# Altium schematic sheet Servo Connectors.SchDoc
size A4
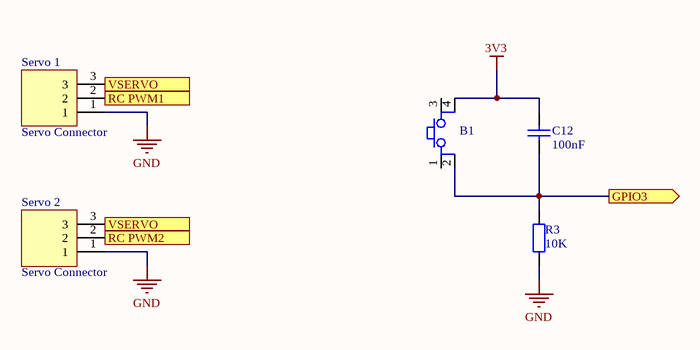
[diagram p0: Servo Connectors.SchDoc]

## Parts
B1  Button  [FP_BTN_SMD]  (value not drawn)
C12  100nF  [FP_0402_CAP_050]
R3  10K  [FP_0603_RES]
Servo_1  Servo Connector  [FP_CONN3_TAP_254MM]
Servo_2  Servo Connector  [FP_CONN3_TAP_254MM]

## Ports
GPIO3 (out), RC PWM1 (in), RC PWM2 (in), VSERVO (in)

## Nets
3V3: B1.4 C12.2
GND: R3.1 Servo_1.1 Servo_2.1
GPIO3: B1.2 C12.1 R3.2 ; port GPIO3
RC PWM1: Servo_1.2 ; port RC PWM1
RC PWM2: Servo_2.2 ; port RC PWM2
VSERVO: Servo_1.3 Servo_2.3 ; port VSERVO

Not connected (* = marked no-connect by the designer): B1 1 3

## Library data of the parts
B1 = Button 4P: Push button
C12 = CAP: Capacitor; Supplier: Farnell; Reference: https://hu.farnell.com/avx/02016d104kat2a/cap-0-1-f-6-3v-10-x5r-0201/dp/1657913; Value: 100nF
R3 = RES: Resistor; Supplier: Farnell; Reference: https://hu.farnell.com/vishay/crcw010010k0frel/res-10k-1-0-031w-01005-thick-film/dp/3546319RL?st=10k%20resistor; Value: 10K
Servo_1 Servo_2 = Connector_3pin: 3pin connector